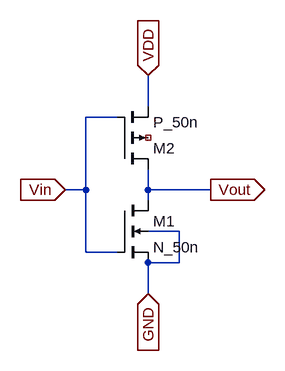
[diagram p0: schematic inverter.asc]
inverter.asc, the LTspice schematic file:
Version 4
SHEET 1 880 680
WIRE 224 64 224 16
WIRE 176 80 128 80
WIRE 128 192 128 80
WIRE 128 192 96 192
WIRE 224 192 224 160
WIRE 320 192 224 192
WIRE 224 208 224 192
WIRE 272 256 224 256
WIRE 128 288 128 192
WIRE 176 288 128 288
WIRE 272 304 272 256
WIRE 272 304 224 304
WIRE 224 352 224 304
FLAG 96 192 Vin
IOPIN 96 192 In
FLAG 224 16 VDD
IOPIN 224 16 In
FLAG 224 352 GND
IOPIN 224 352 In
FLAG 320 192 Vout
IOPIN 320 192 Out
SYMBOL nmos4 176 208 R0
SYMATTR InstName M1
SYMATTR Value N_50n
SYMATTR Value2 l=50n w=500n
SYMBOL pmos4 176 160 M180
SYMATTR InstName M2
SYMATTR Value P_50n
SYMATTR Value2 l=50n w=1u

The netlist it stands for:
* inverter.asc
M1 Vout Vin GND GND N_50n l=50n w=500n
M2 Vout Vin VDD NC_01 P_50n l=50n w=1u
.model NMOS NMOS
.model PMOS PMOS
.lib standard.mos
.backanno
.end